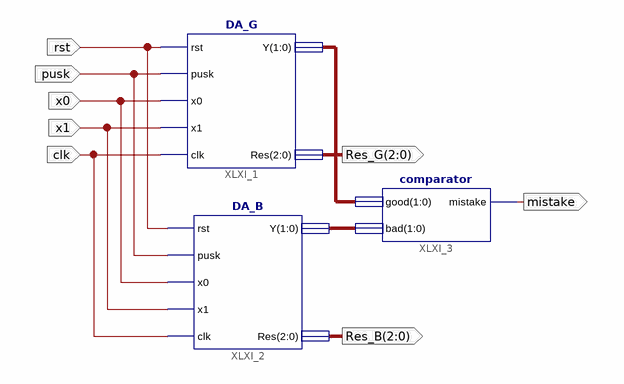
[diagram p0: schematic sheet 1]
// Xilinx ISE schematic scheme.sch (spartan3a) as structural Verilog: 3 symbols, 8 ports
module scheme (
  input  rst,
  input  pusk,
  input  x0,
  input  x1,
  input  clk,
  output [2:0] Res_G,
  output [2:0] Res_B,
  output mistake
);

  wire [1:0] XLXN_2, XLXN_17;

  DA_G XLXI_1 (.rst(rst), .pusk(pusk), .x0(x0), .x1(x1), .clk(clk), .Y(XLXN_17), .Res(Res_G));
  DA_B XLXI_2 (.rst(rst), .pusk(pusk), .x0(x0), .x1(x1), .clk(clk), .Y(XLXN_2), .Res(Res_B));
  comparator XLXI_3 (.good(XLXN_17), .bad(XLXN_2), .mistake(mistake));
endmodule
